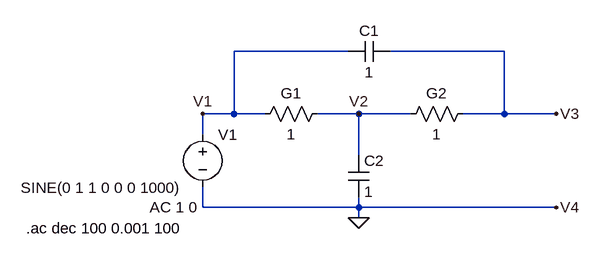
[diagram p0: schematic t_puenteado.asc]
t_puenteado.asc, the LTspice schematic file:
Version 4
SHEET 1 880 680
WIRE 192 48 16 48
WIRE 432 48 256 48
WIRE 16 144 16 48
WIRE 16 144 -32 144
WIRE 64 144 16 144
WIRE 208 144 144 144
WIRE 288 144 208 144
WIRE 432 144 432 48
WIRE 432 144 368 144
WIRE 512 144 432 144
WIRE -32 176 -32 144
WIRE 208 208 208 144
WIRE -32 288 -32 256
WIRE 208 288 208 272
WIRE 208 288 -32 288
WIRE 512 288 208 288
WIRE 208 304 208 288
FLAG 208 304 0
FLAG 512 144 V3
FLAG 512 288 V4
FLAG -32 144 V1
FLAG 208 144 V2
SYMBOL res 160 128 R90
WINDOW 0 0 56 VBottom 2
WINDOW 3 32 56 VTop 2
SYMATTR InstName G1
SYMATTR Value 1
SYMBOL res 384 128 R90
WINDOW 0 0 56 VBottom 2
WINDOW 3 32 56 VTop 2
SYMATTR InstName G2
SYMATTR Value 1
SYMBOL cap 192 208 R0
SYMATTR InstName C2
SYMATTR Value 1
SYMBOL cap 256 32 R90
WINDOW 0 0 32 VBottom 2
WINDOW 3 32 32 VTop 2
SYMATTR InstName C1
SYMATTR Value 1
SYMBOL voltage -32 160 R0
WINDOW 3 -280 98 Left 2
WINDOW 123 -82 128 Left 2
WINDOW 39 0 0 Left 0
SYMATTR InstName V1
SYMATTR Value SINE(0 1 1 0 0 0 1000)
SYMATTR Value2 AC 1 0
TEXT -304 320 Left 2 !.ac dec 100 0.001 100

The netlist it stands for:
* t_puenteado.asc
R§G1 V2 V1 1
R§G2 V3 V2 1
C2 V2 0 1
C1 V3 V1 1
V1 V1 0 SINE(0 1 1 0 0 0 1000) AC 1 0
.ac dec 100 0.001 100
.backanno
.end